# EAGLE design PI2AX (EAGLE 7.7.0)
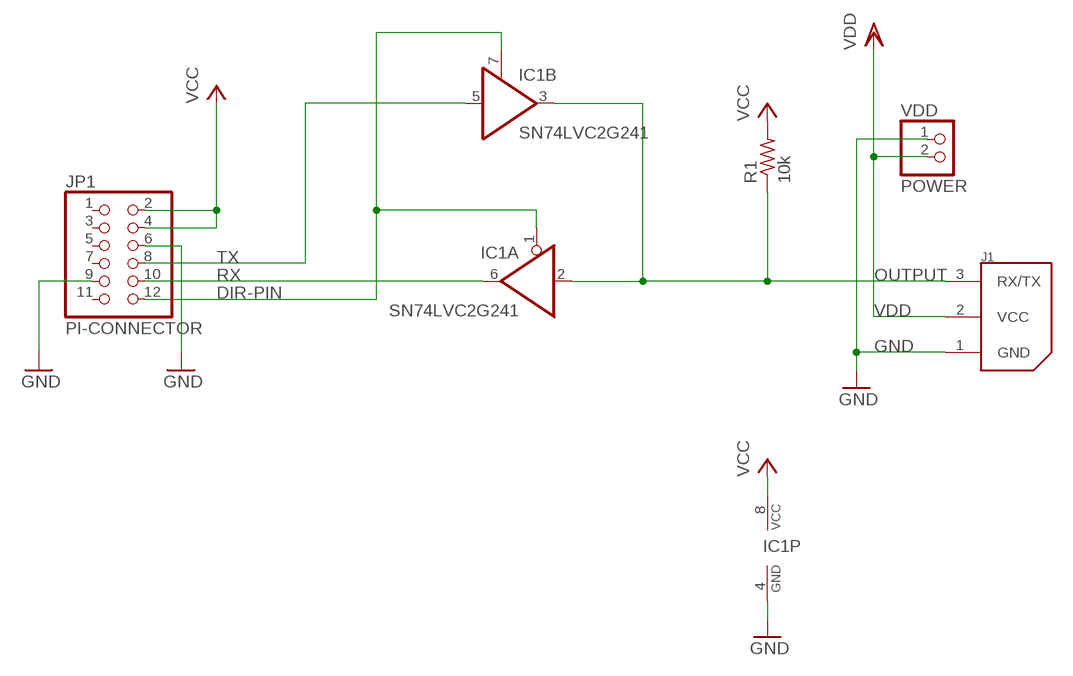
[diagram p0: schematic, sheet 1]

## Parts
IC1  SN74LVC2G241  [SSOP08]
J1  22-03-5035  [5267-3]
JP1  PI-CONNECTOR  PINHD-2X6  [2X06]
R1  10k  R-US_R0805  [R0805]
VDD  POWER  PINHD-1X2  [1X02]

## Nets
DIR-PIN: IC1.1(A:OE) IC1.7(B:OE) JP1.12
GND: IC1.4(P:GND) J1.1(GND) JP1.6 JP1.9 VDD.1
OUTPUT: IC1.2(A:I) IC1.3(B:O) J1.3(RX/TX) R1.1
RX: IC1.6(A:O) JP1.10
TX: IC1.5(B:I) JP1.8
VCC: IC1.8(P:VCC) JP1.2 JP1.4 R1.2
VDD: J1.2(VCC) VDD.2
Unconnected: JP1.1 JP1.3 JP1.5 JP1.7 JP1.11

## Library data of the parts
IC1 = 74xx-little-de:SN74LVC2G241: Dual Bus Buffer Gate With 3-State Outputs Source: http://www.ti.com/product/SN74LVC2G240/quality
J1 = molex:22-03-5035: Molex SPOX Vert, Tin (Dynamixel AX/MX Bus) tested: YES (arbotix)
JP1 = pinhead:PINHD-2X6: PIN HEADER
R1 = resistor:R-US_: RESISTOR, American symbol
VDD = pinhead:PINHD-1X2: PIN HEADER

## Board
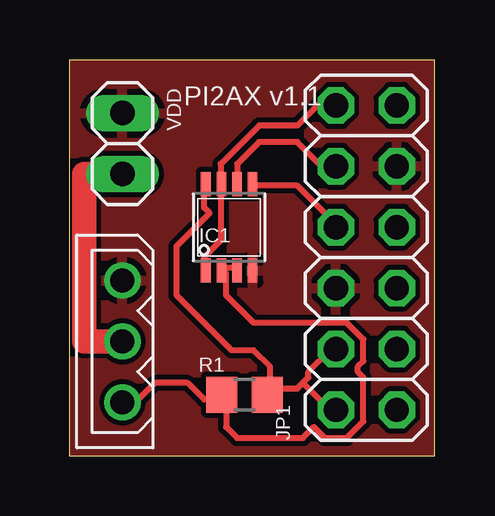
[diagram p1: board, top side]
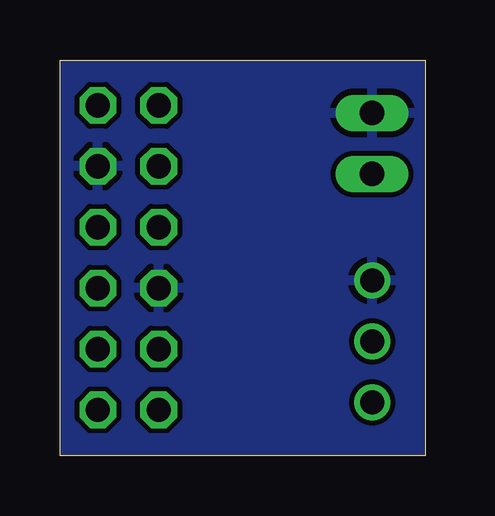
[diagram p2: board, bottom side, seen from below]

Size 15.23 x 16.5 mm. Coordinates in mm from the lower left corner, seen from the top.
Outline: 0,0 15.23,0 15.23,16.5 0,16.5 0,0
Copper layers (1*16): Top 0.035mm / dielectric 1.5mm / Bottom 0.035mm
Design rules "default *": minimum track width 10mil, minimum drill 24mil, track to track 8mil, track to pad 8mil, pad to pad 8mil, via to via 8mil, smd to smd 8mil, copper to edge 1mil, drill to drill 8mil, minimum pad ring 10mil, minimum via ring 8mil, stop-mask expansion 4mil, vias tented up to drill 0mil, thermal gap 10mil

### Footprints (pad centres in the part's own frame; a part is rotated, then mirrored left to right if it is on the bottom)
SSOP08 = smd 0.4 x 1: 1 -0.975,-1.8; 2 -0.325,-1.8; 3 0.325,-1.8; 4 0.975,-1.8; 5 0.975,1.8; 6 0.325,1.8; 7 -0.325,1.8; 8 -0.975,1.8
5267-3 = drill 1: 1 0,0; 2 -2.54,0; 3 -5.08,0
2X06 = drill 1.016 octagon: 1 -6.35,-1.27; 2 -6.35,1.27; 3 -3.81,-1.27; 4 -3.81,1.27; 5 -1.27,-1.27; 6 -1.27,1.27; 7 1.27,-1.27; 8 1.27,1.27; 9 3.81,-1.27; 10 3.81,1.27; 11 6.35,-1.27; 12 6.35,1.27
R0805 = smd 1.3 x 1.5: 1 -0.95,0; 2 0.95,0
1X02 = drill 1.016 long: 1 -1.27,0; 2 1.27,0

### Placement (x,y rotation side)
IC1  6.67,9.53 0 top
J1  2.22,7.3 90 top
JP1  12.38,8.26 90 top
R1  7.3,2.54 0 top
VDD  2.22,13.02 270 top

### Tracks (layer width: path | path; a pad name or v marks a point on that pad's centre or on a via)
DIR-PIN
  Top 0.254: IC1.1 5.63,7.82 5.63,8.28 6.31,8.97 6.31,11.25 IC1.7 6.31,11.48 6.31,12.17 7.91,13.77 9.51,13.77 10.43,14.68 11.11,14.68 JP1.12
GND
  pour Top: 0,16.51 15.24,16.51 15.24,0 0,0
  pour Bottom: 0,16.51 15.24,16.51 15.24,0 0,0
OUTPUT
  Top 0.254: IC1.3 7,7.82 6.54,7.82 IC1.2 6.54,7.6 6.54,6.68 7.68,5.54 11.57,5.54 12.26,4.85 12.26,3.94 12.03,3.71 12.03,3.48 12.26,3.25 12.26,1.42 11.57,0.74 10.66,0.74 10.2,1.19 9.74,0.74 7,0.74 6.54,1.19 6.54,2.34 R1.1 6.31,2.34 5.63,2.34 4.94,3.02 3.57,3.02 2.88,2.34 2.43,2.34 J1.3
RX
  Top 0.254: IC1.6 7,11.48 7,12.17 7.91,13.08 9.51,13.08 10.43,12.17 11.11,12.17 JP1.10
TX
  Top 0.254: IC1.5 7.68,11.25 9.51,11.25 11.11,9.65 JP1.8
VCC
  Top 0.254: 8.37,2.79 8.37,2.57 R1.2 8.37,2.79 | 8.37,2.79 8.37,3.71 7.68,4.39 6.77,4.39 4.48,6.68 4.48,8.74 5.85,10.11 5.63,10.34 5.63,11.25 IC1.8 | 9.74,3.02 10.66,2.11 11.11,2.11 JP1.2 | 9.74,3.02 9.51,2.79 8.37,2.79 | 9.74,3.02 9.97,3.25 9.97,3.48 10.88,4.39 11.11,4.39 JP1.4
VDD
  Top 1.016: J1.2 0.64,4.76 0.64,11.75 VDD.2

### Text on the board
tNames: PI2AX v1.1